# EAGLE schematic 5VAC-DC (EAGLE 9.6.2)
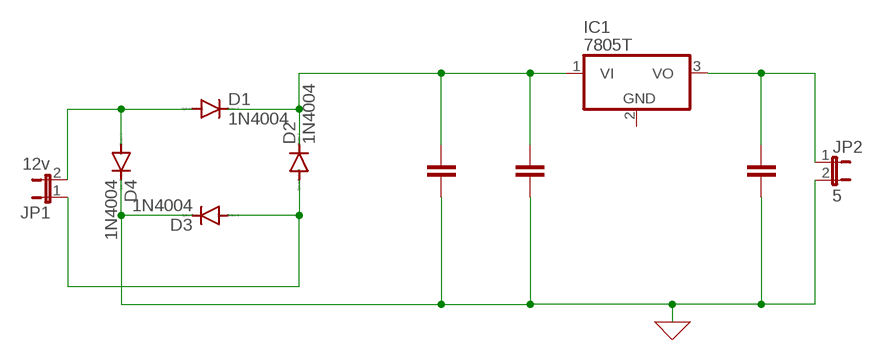
[diagram p0: schematic, sheet 1]

## Parts
D1  1N4004  [DO41-10]
D2  1N4004  [DO41-10]
D3  1N4004  [DO41-10]
D4  1N4004  [DO41-10]
IC1  7805T  [TO220H]
JP1  12v  JP1E  [JP1]
JP2  5  JP1E  [JP1]

## Nets
0: D3.C D4.C JP2.2 ; supply symbol labelled GND
N$1: D1.A D4.A JP1.2
N$2: D1.C D2.C IC1.1(VI)
N$3: D2.A D3.A JP1.1
N$6: IC1.3(VO) JP2.1
Unconnected: IC1.2(GND)

## Library data of the parts
D1-D4 = diode:1N4004: DIODE general purpose rectifier, 1 A
IC1 = linear:78*: Positive VOLTAGE REGULATOR Source: http://cache.national.com/ds/LM/LM78L05.pdf http://www.fairchildsemi.com/ds/LM/LM7805.pdf
JP1 JP2 = jumper:JP1E: JUMPER